# EAGLE design itrope-serial-v01 (EAGLE 7.2.0)
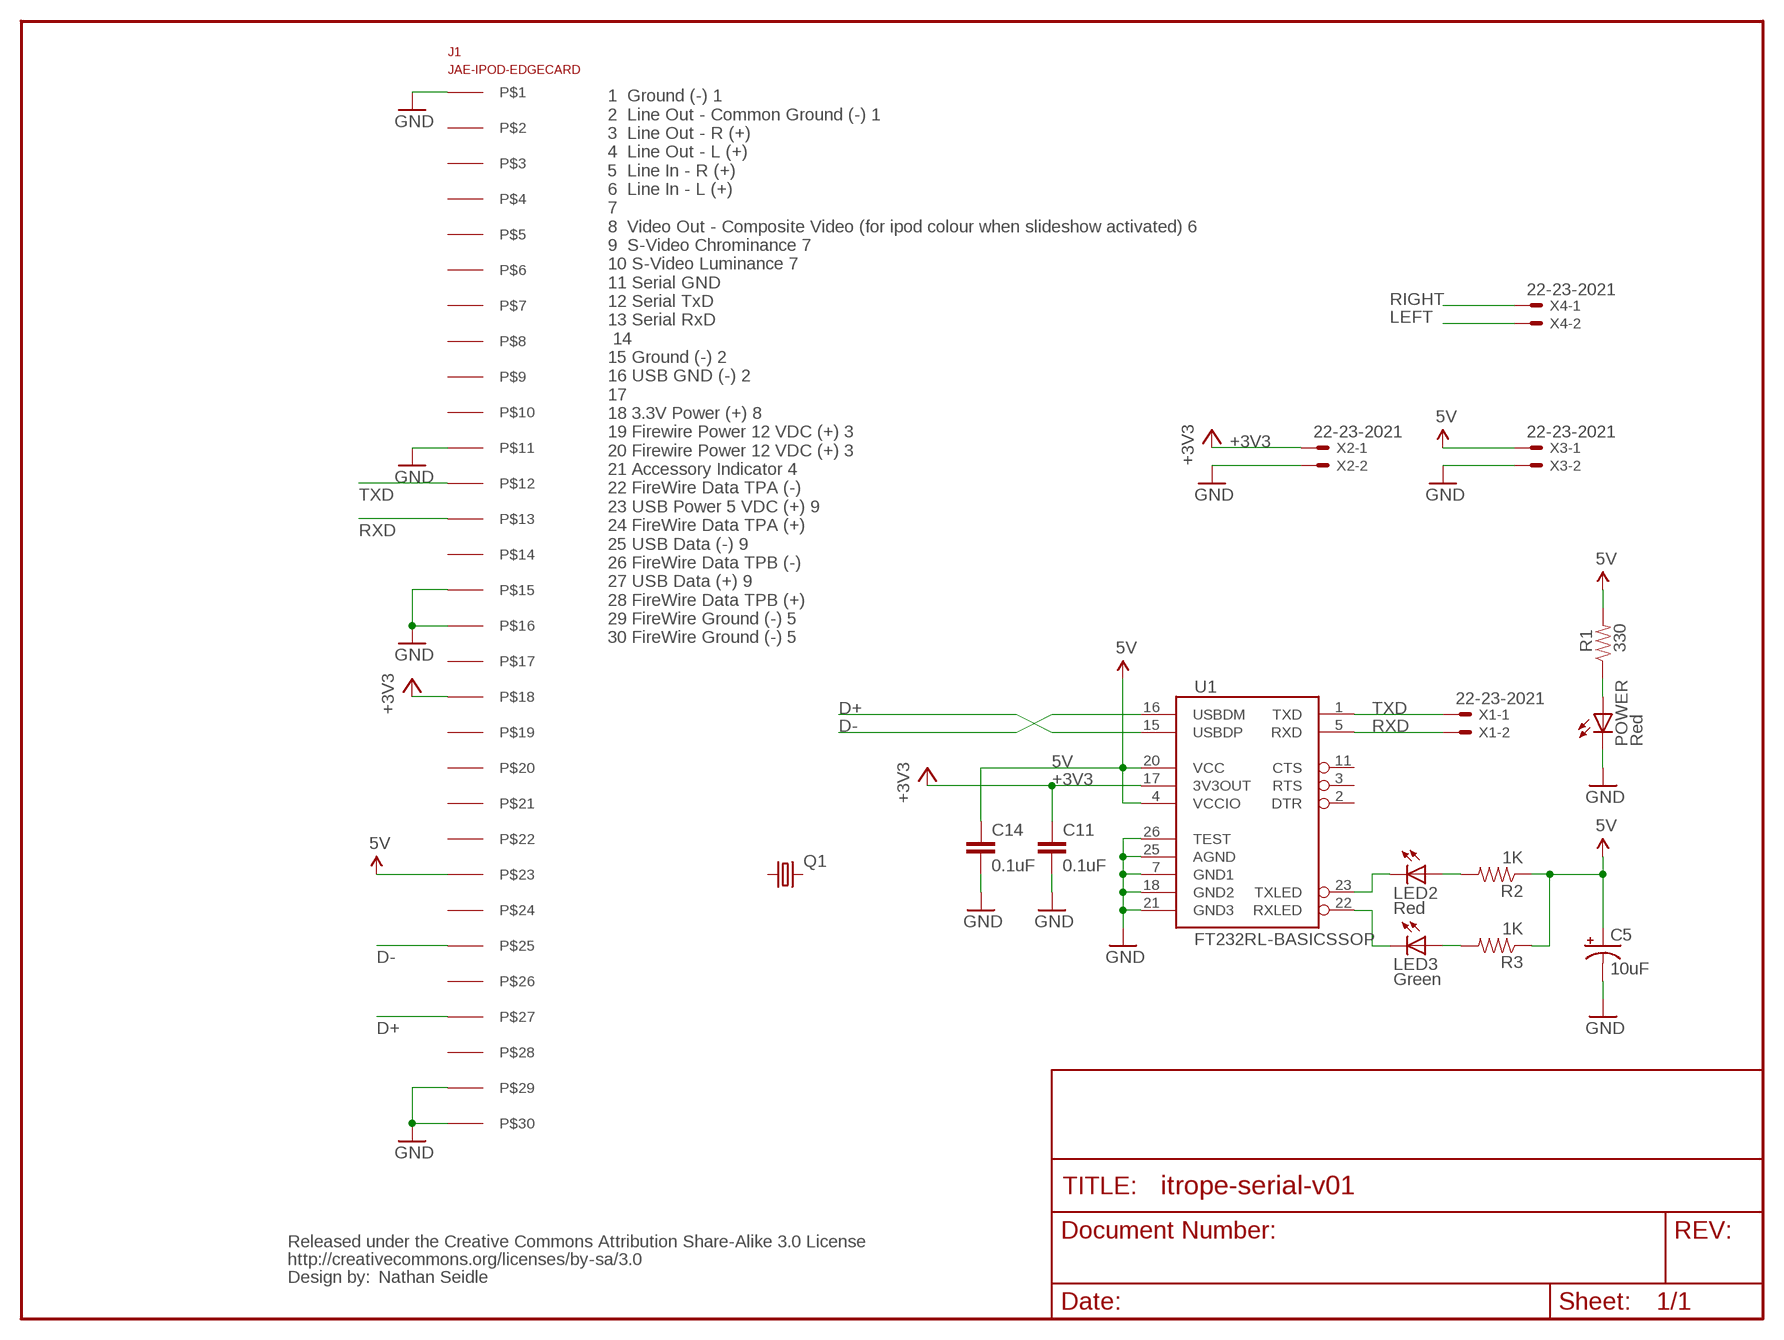
[diagram p0: schematic, sheet 1]

## Parts
C5  10uF  CAP_POL1206  [EIA3216]
C11  0.1uF  CAP0402  [C0402]
C14  0.1uF  CAP0402  [C0402]
J1  JAE-IPOD-EDGECARD  [30PINEDGE]
LED2  Red  LED0603  [LED-0603]
LED3  Green  LED0603  [LED-0603]
POWER  Red  LED0603  [LED-0603]
Q1  CRYSTALSM49  [SM49]
R1  330  RESISTOR0402  [C0402]
R2  1K  RESISTOR0402  [C0402]
R3  1K  RESISTOR0402  [C0402]
U1  FT232RL-BASICSSOP  [SSOP28DB]
U$9  CREATIVE_COMMONS  [CREATIVE_COMMONS]
X1  22-23-2021  [22-23-2021]
X2  22-23-2021  [22-23-2021]
X3  22-23-2021  [22-23-2021]
X4  22-23-2021  [22-23-2021]

## Nets
5V [vcc]: C5.A(+) C14.1 J1.P$23 R1.2 R2.1 R3.1 U1.4(VCCIO) U1.20(VCC) X3.1
+3V3: C11.1 J1.P$18 U1.17(3V3OUT) X2.1
D+: J1.P$27 U1.15(USBDP)
D-: J1.P$25 U1.16(USBDM)
GND [vcc]: C5.C(-) C11.2 C14.2 J1.P$1 J1.P$11 J1.P$15 J1.P$16 J1.P$29 J1.P$30 POWER.C U1.7(GND1) U1.18(GND2) U1.21(GND3) U1.25(AGND) U1.26(TEST) X2.2 X3.2
LEFT: X4.2
N$1: POWER.A R1.1
N$3: LED2.A R2.2
N$4: LED3.A R3.2
RIGHT: X4.1
RXD: J1.P$13 U1.5(RXD) X1.2
RXLED: LED3.C U1.22(RXLED)
TXD: J1.P$12 U1.1(TXD) X1.1
TXLED: LED2.C U1.23(TXLED)
Unconnected: J1.P$2 J1.P$3 J1.P$4 J1.P$5 J1.P$6 J1.P$7 J1.P$8 J1.P$9 J1.P$10 J1.P$14 J1.P$17 J1.P$19 J1.P$20 J1.P$21 J1.P$22 J1.P$24 J1.P$26 J1.P$28 Q1.1 Q1.2 U1.2(DTR) U1.3(RTS) U1.11(CTS)

## Notes on the sheet
- 1  Ground (-) 1
  2  Line Out - Common Ground (-) 1
  3  Line Out - R (+)
  4  Line Out - L (+)
  5  Line In - R (+)
  6  Line In - L (+)
  7
  8  Video Out - Composite Video (for ipod colour when slideshow activated) 6
  9  S-Video Chrominance 7
  10 S-Video Luminance 7
  11 Serial GND
  12 Serial TxD
  13 Serial RxD
   14
  15 Ground (-) 2
  16 USB GND (-) 2
  17
  18 3.3V Power (+) 8
  19 Firewire Power 12 VDC (+) 3
  20 Firewire Power 12 VDC (+) 3
  21 Accessory Indicator 4
  22 FireWire Data TPA (-)
  23 USB Power 5 VDC (+) 9
  24 FireWire Data TPA (+)
  25 USB Data (-) 9
  26 FireWire Data TPB (-)
  27 USB Data (+) 9
  28 FireWire Data TPB (+)
  29 FireWire Ground (-) 5
  30 FireWire Ground (-) 5
- Nathan Seidle

## Library data of the parts
C5 = SparkFun:CAP_POL: Capacitor Polarized These are standard SMD and PTH capacitors. Normally 10uF, 47uF, and 100uF in electrolytic and tantalum varieties. Always verify the external diameter of the through hole cap, it varies with capacity, voltage, and manufacturer. The EIA devices should be standard.
C11 C14 = SparkFun:CAP: Capacitor Standard 0603 ceramic capacitor, and 0.1" leaded capacitor.
J1 = con-jae-IPOD-edgecard:JAE-IPOD-EDGECARD
LED2 LED3 POWER = SparkFun:LED: LEDs Standard schematic elements and footprints for 5mm, 3mm, 1206, and 0603 sized LEDs. 5mm - Spark Fun Electronics SKU : COM-00529 (and others)
Q1 = crystal:CRYSTAL: CRYSTAL; OC_FARNELL: unknown; OC_NEWARK: unknown
R1-R3 = SparkFun:RESISTOR: Resistor Basic schematic elements and footprints for 0603, 1206, and PTH 1/10th watt (small) resistors.
U1 = SparkFun:FT232RL-BASIC: USB UART This is the simplified version of the FT232RL unit. Only what you need, nothing you don't. Spark Fun Electronics SKU : COM-00650
U$9 = SparkFun:CREATIVE_COMMONS
X1-X4 = con-molex:22-23-2021: .100" (2.54mm) Center Header - 2 Pin; MF: MOLEX; MPN: 22-23-2021; OC_FARNELL: 1462926; OC_NEWARK: 25C3832

## Net classes
1 vcc: width 0.203 mm

## Board
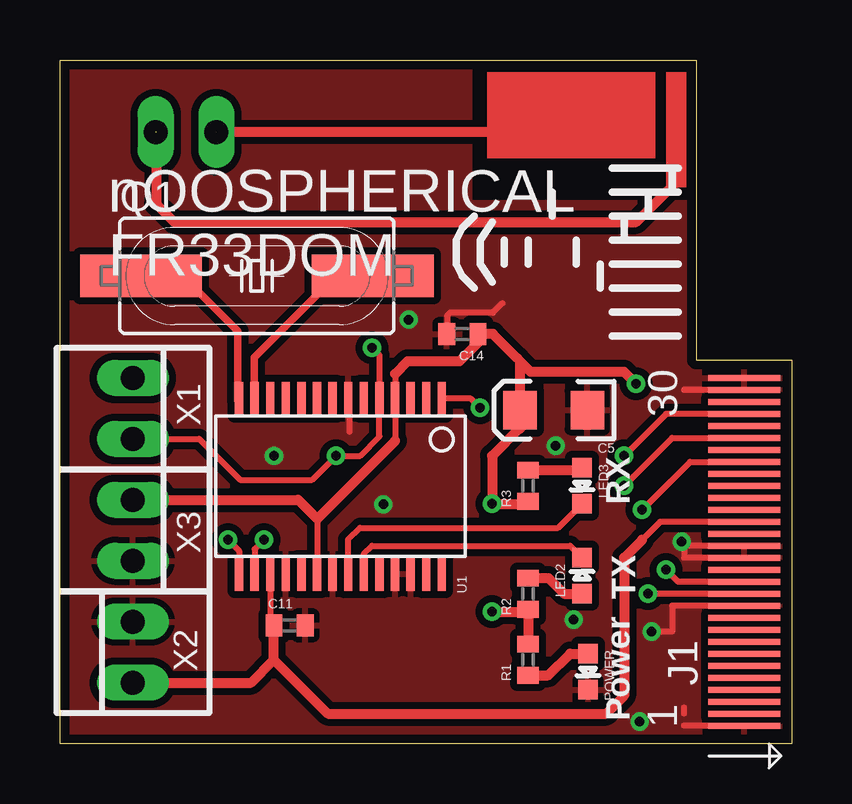
[diagram p1: board, top side]
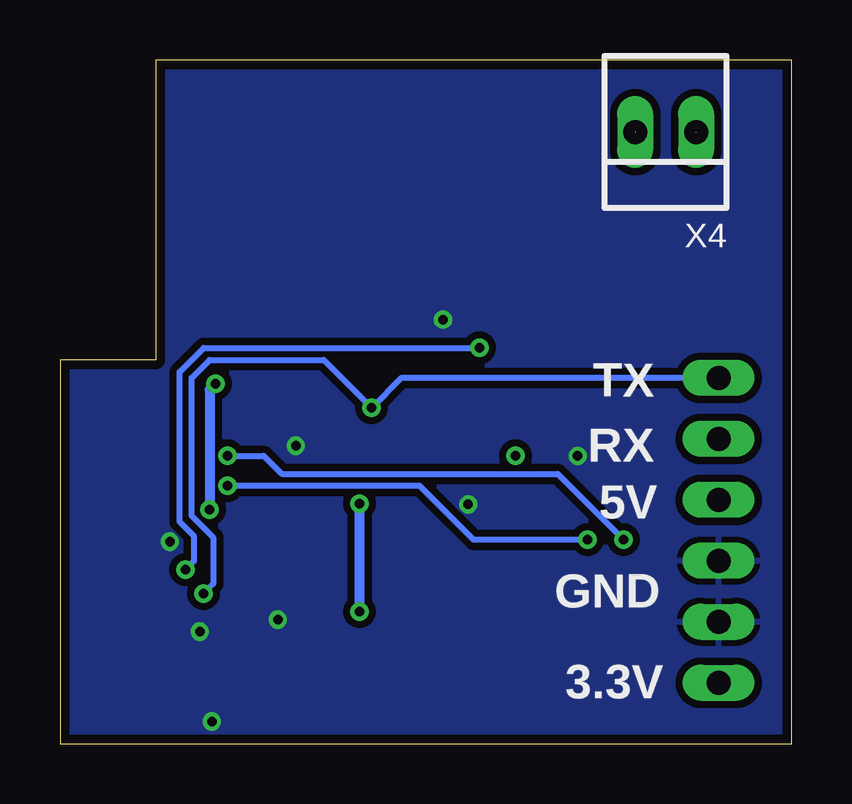
[diagram p2: board, bottom side, seen from below]

Size 30.48 x 28.5 mm. Coordinates in mm from the lower left corner, seen from the top.
Outline: 0,28.5 26.5,28.5 26.5,16 30.48,16 30.48,0 0,0 0,28.5
Copper layers (1*16): Top 0.0356mm / dielectric 1.5011mm / Bottom 0.0356mm
Design rules "LaenPCBOrder": minimum track width 6mil, minimum drill 13mil, track to track 6mil, track to pad 6mil, pad to pad 6mil, via to via 6mil, smd to smd 6mil, copper to edge 15mil, drill to drill 6mil, minimum pad ring 7mil, minimum via ring 7mil, stop-mask expansion 3mil, vias tented up to drill 0mil, thermal gap 10mil

### Footprints (pad centres in the part's own frame; a part is rotated, then mirrored left to right if it is on the bottom)
EIA3216 = smd 1.4 x 1.6: A 1.4,0; C -1.4,0
C0402 = smd 0.7 x 0.9: 1 -0.65,0; 2 0.65,0
30PINEDGE = smd 0.25 x 3: P$1 7.25,1.5; P$2 6.75,1.5; P$3 6.25,1.5; P$4 5.75,1.5; P$5 5.25,1.5; P$6 4.75,1.5; P$7 4.25,1.5; P$8 3.75,1.5; P$9 3.25,1.5; P$10 2.75,1.5; P$11 2.25,1.5; P$12 1.75,1.5; P$13 1.25,1.5; P$14 0.75,1.5; P$15 0.25,1.5; P$16 -0.25,1.5; P$17 -0.75,1.5; P$18 -1.25,1.5; P$19 -1.75,1.5; P$20 -2.25,1.5; P$21 -2.75,1.5; P$22 -3.25,1.5; P$23 -3.75,1.5; P$24 -4.25,1.5; P$25 -4.75,1.5; P$26 -5.25,1.5; P$27 -5.75,1.5; P$28 -6.25,1.5; P$29 -6.75,1.5; P$30 -7.25,1.5
LED-0603 = smd 0.8 x 0.8: A 0,-0.75; C 0,0.75
SM49 = smd 5.08 x 1.778: 1 -4.826,0; 2 4.826,0
SSOP28DB = smd 0.348 x 1.397: 1 -4.225,-3.656; 2 -3.575,-3.656; 3 -2.925,-3.656; 4 -2.275,-3.656; 5 -1.625,-3.656; 6 -0.975,-3.656; 7 -0.325,-3.656; 8 0.325,-3.656; 9 0.975,-3.656; 10 1.625,-3.656; 11 2.275,-3.656; 12 2.925,-3.656; 13 3.575,-3.656; 14 4.225,-3.656; 15 4.225,3.656; 16 3.575,3.656; 17 2.925,3.656; 18 2.275,3.656; 19 1.625,3.656; 20 0.975,3.656; 21 0.325,3.656; 22 -0.325,3.656; 23 -0.975,3.656; 24 -1.625,3.656; 25 -2.275,3.656; 26 -2.925,3.656; 27 -3.575,3.656; 28 -4.225,3.656
22-23-2021 = drill 1 long: 1 -1.27,0; 2 1.27,0

### Placement (x,y rotation side)
C5  20.57,13.9 180 top
C11  9.57,4.93 0 top
C14  16.76,17.07 180 top
J1  27,8 270 top
LED2  21.75,7 0 top
LED3  21.75,10.75 180 top
POWER  22,3 180 top
Q1  8.2,19.5 0 top
R1  19.5,3.5 90 top
R2  19.5,6.25 90 top
R3  19.5,10.75 90 top
U1  11.68,10.72 180 top
U$9  -9.18,-27.14 0 top  (outside the outline)
X1  3.04,13.97 270 top
X2  3.04,3.81 90 top
X3  3.04,8.89 270 top
X4  5.25,25.5 180 bottom

### Tracks (layer width: path | path; a pad name or v marks a point on that pad's centre or on a via)
5V  (via drill 0.4)
  Top 0.254: C14.1 17.41,16.71 | 19.3,10.09 R3.1 | 19.17,15.93 19.05,16.05 | 19.17,13.13 C5.A | 13.96,12.62 U1.4 13.96,15.41 | 10.71,9.37 U1.20 | v24.25,9.75 26.25,11.75 J1.P$23
  Top 0.406: 13.96,15.41 14.48,15.93 16.64,15.93 17.41,16.71 | C5.A 19.17,15.93 19.61,15.5 23.5,15.5 v24,15 | 19.05,16.05 18.03,17.07 C14.1 | 13.96,12.62 10.71,9.37 9.92,10.16 X3.1 | 19.35,4 R1.2 R2.1 19.4,5.5 v18,5.5 | R3.1 19.4,10 v18,10 18,12 19.13,13.13 19.17,13.13
  Bottom 0.406: v18,5.5 v18,10 | v24,15 24.25,14.75 v24.25,9.75
+3V3
  Top 0.254: U1.17 8.76,5.08 C11.1 | J1.P$18 25,9.25 24.25,8.5
  Top 0.406: X2.1 7.96,2.54 8.92,3.5 | 8.92,3.5 C11.1 | 8.92,3.5 11.16,1.25 22.75,1.25 23.5,2 23.5,7.75 24.25,8.5
D+  (via drill 0.4)
  Top 0.254: v7,8.5 7.46,8.04 U1.15 | J1.P$27 25.25,13.75 v23.5,12
  Bottom 0.254: v23.5,12 22,12 21.25,11.25 9.75,11.25 v7,8.5
D-  (via drill 0.4)
  Top 0.254: v8.5,8.5 8.11,8.11 U1.16 | v23.5,10.75 25.5,12.75 J1.P$25
  Bottom 0.254: v8.5,8.5 13.25,8.5 15.5,10.75 v23.5,10.75
GND  (via drill 0.4)
  Top 0.254: C14.2 16.13,17.09 16.13,17.84 16.26,17.96 18.03,17.96 18.43,18.36 | U1.7 12.06,14.32 12.06,13 | 26,1.25 26,1.5 | J1.P$29 26,14.75 | J1.P$16 26,8.25 26,7.75 J1.P$15 | J1.P$11 25.5,5.75 25.5,4.66 v24.65,4.66 | J1.P$1 26,0.75
  other vias: 14.52,17.67 8.91,11.99 13.47,9.97 24.15,0.91 20.65,12.41 21.4,5.16 25.9,8.41
  pour Top (isolate 0.3): 0,0 0,28.4 17.05,28.25 17.05,22.55 27,22.55 27,28.4 30.48,28.4 30.48,0
  pour Bottom (isolate 0.305): 0,0 0,28.4 30.48,28.4 30.48,0
LEFT  (1 unrouted)
  Top 0.406: 18.75,25.5 6.5,25.5
  pour Top: 24.75,28 17.75,28 17.75,24.45 24.75,24.45
N$1
  Top 0.254: POWER.A 21.84,3.87 21.73,3.75
  Top 0.406: R1.1 20.35,2.85 21.25,3.75 POWER.A
N$2
  Top 0.305: 4.6,19.2 5.4,19.2 7.4,17.2 7.4,14.3
N$3
  Top 0.406: R2.2 20.35,6.9 21,6.25 LED2.A
N$4
  Top 0.406: R3.2 21.65,11.4 LED3.A
N$5
  Top 0.305: 11.4,19.4 8.1,16.1 8.1,14.4
RIGHT  (1 unrouted)
  Top 0.406: 4,25.5 4,22.5 4.75,21.75 24,21.75 25.75,23.5
  pour Top: 26,28 25.25,28 25.25,23.25 26,23.25
RXD  (via drill 0.4)
  Top 0.254: X1.2 5.8,12.7 7.5,11 10.5,11 v11.5,12 12.5,12 13.31,12.81 U1.5 13.31,16.19 v13,16.5 | J1.P$13 25.75,6.75 v25.25,7.25
  Bottom 0.254: v13,16.5 24.5,16.5 25.5,15.5 25.5,9.25 24.9,8.65 24.9,7.6 v25.25,7.25
RXLED
  Top 0.254: U1.22 12.01,8.51 12.5,9 20.75,9 LED3.C
TXD  (via drill 0.4)
  Top 0.254: v17.5,14 17.12,14.38 U1.1 | J1.P$12 v24.5,6.25
  Bottom 0.254: X1.1 16.26,15.24 v17.5,14 19.5,16 24.25,16 25,15.25 25,9.5 24.1,8.6 24.1,6.65 v24.5,6.25
TXLED
  Top 0.254: U1.23 12.66,7.91 13,8.25 21.25,8.25 LED2.C
(copper drawn outside any net)
  shapes: Top area x2

### Text on the board
tPlace: RX | TX | Power
bPlace: TX | RX | 5V | GND | 3.3V
tNames: nOOSPHERICAL / FR33DOM
Measures: R | L